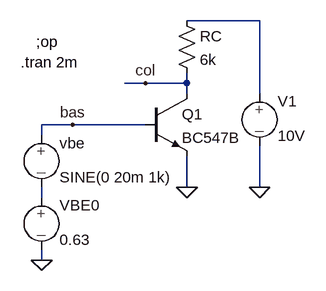
[diagram p0: schematic q1-verst-1.asc]
q1-verst-1.asc, the LTspice schematic file:
Version 4
SHEET 1 880 680
WIRE 320 16 208 16
WIRE 144 112 112 112
WIRE 208 112 208 96
WIRE 208 112 144 112
WIRE 208 128 208 112
WIRE 320 128 320 16
WIRE 32 176 -16 176
WIRE 144 176 32 176
WIRE -16 192 -16 176
WIRE 208 272 208 224
WIRE 320 272 320 208
WIRE -16 288 -16 272
WIRE -16 384 -16 368
FLAG 208 272 0
FLAG 320 272 0
FLAG -16 384 0
FLAG 32 176 bas
FLAG 144 112 col
SYMBOL EIT_Semiconductors\\npn 144 128 R0
SYMATTR InstName Q1
SYMATTR Value BC547B
SYMBOL source-V 320 112 R0
SYMATTR InstName V1
SYMATTR Value 10V
SYMBOL source-V -16 176 R0
WINDOW 123 0 0 Left 2
WINDOW 39 0 0 Left 2
SYMATTR InstName vbe
SYMATTR Value SINE(0 20m 1k)
SYMBOL source-V -16 272 R0
SYMATTR InstName VBE0
SYMATTR Value 0.63
SYMBOL res 192 0 R0
SYMATTR InstName RC
SYMATTR Value 6k
TEXT -24 48 Left 2 !;op
TEXT -48 80 Left 2 !.tran 2m

The netlist it stands for:
* q1-verst-1.asc
Q1 col bas 0 0 BC547B
V1 N001 0 10V
vbe bas N002 SINE(0 20m 1k)
VBE0 N002 0 0.63
RC N001 col 6k
.model NPN NPN
.model PNP PNP
.lib standard.bjt
;op
.tran 2m
.backanno
.end